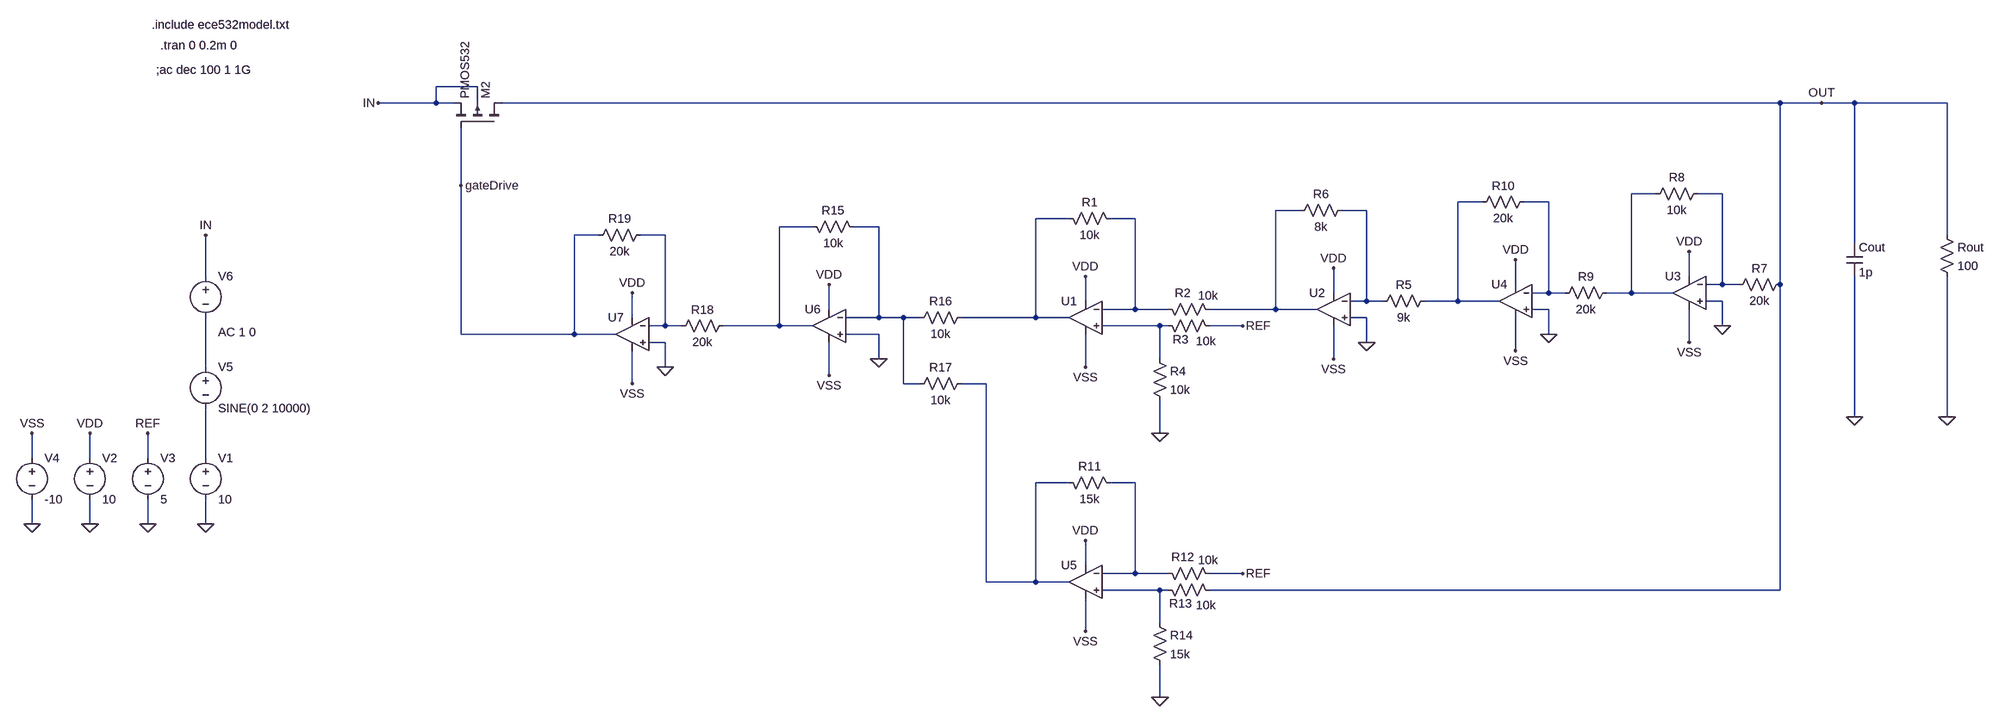
[diagram p0: schematic LDO_v2_compensated_feedback.asc]
LDO_v2_compensated_feedback.asc, the LTspice schematic file:
Version 4
SHEET 1 3668 1268
WIRE -272 64 -352 64
WIRE -352 96 -352 64
WIRE -352 96 -656 96
WIRE -320 96 -352 96
WIRE -272 96 -272 64
WIRE 2368 96 -224 96
WIRE 2448 96 2368 96
WIRE 2512 96 2448 96
WIRE 2704 96 2512 96
WIRE -304 256 -304 144
WIRE 2128 272 2080 272
WIRE 2256 272 2208 272
WIRE 1792 288 1744 288
WIRE 1920 288 1872 288
WIRE 1440 304 1392 304
WIRE 1568 304 1520 304
WIRE 992 320 928 320
WIRE 1120 320 1072 320
WIRE 496 336 432 336
WIRE 624 336 576 336
WIRE 48 352 0 352
WIRE 176 352 128 352
WIRE 2704 352 2704 96
WIRE 2512 368 2512 96
WIRE -1088 432 -1088 352
WIRE 2192 432 2192 384
WIRE 1856 448 1856 400
WIRE 2256 448 2256 272
WIRE 2256 448 2224 448
WIRE 2288 448 2256 448
WIRE 2368 448 2368 96
WIRE 1504 464 1504 416
WIRE 1920 464 1920 288
WIRE 1920 464 1888 464
WIRE 1952 464 1920 464
WIRE 2080 464 2080 272
WIRE 2080 464 2032 464
WIRE 2160 464 2080 464
WIRE 1024 480 1024 432
WIRE 1568 480 1568 304
WIRE 1568 480 1536 480
WIRE 1600 480 1568 480
WIRE 1744 480 1744 288
WIRE 1744 480 1680 480
WIRE 1824 480 1744 480
WIRE 2256 480 2224 480
WIRE 528 496 528 448
WIRE 1120 496 1120 320
WIRE 1120 496 1056 496
WIRE 1184 496 1120 496
WIRE 1392 496 1392 304
WIRE 1392 496 1264 496
WIRE 1472 496 1392 496
WIRE 1920 496 1888 496
WIRE 112 512 112 464
WIRE 624 512 624 336
WIRE 624 512 560 512
WIRE 672 512 624 512
WIRE 704 512 672 512
WIRE 928 512 928 320
WIRE 928 512 784 512
WIRE 992 512 928 512
WIRE 1568 512 1536 512
WIRE 176 528 176 352
WIRE 176 528 144 528
WIRE 208 528 176 528
WIRE 432 528 432 336
WIRE 432 528 288 528
WIRE 496 528 432 528
WIRE 1168 528 1056 528
WIRE 1184 528 1168 528
WIRE 1328 528 1264 528
WIRE 2256 528 2256 480
WIRE -304 544 -304 256
WIRE 0 544 0 352
WIRE 0 544 -304 544
WIRE 80 544 0 544
WIRE 624 544 560 544
WIRE 1920 544 1920 496
WIRE 176 560 144 560
WIRE 1568 560 1568 512
WIRE 2192 560 2192 496
WIRE 1856 576 1856 512
WIRE 624 592 624 544
WIRE 1168 592 1168 528
WIRE 1504 592 1504 528
WIRE -1088 608 -1088 512
WIRE 176 608 176 560
WIRE 1024 608 1024 544
WIRE 528 624 528 560
WIRE 112 640 112 576
WIRE 672 640 672 512
WIRE 704 640 672 640
WIRE 832 640 784 640
WIRE 2512 704 2512 432
WIRE 2704 704 2704 432
WIRE 1168 736 1168 672
WIRE -1424 784 -1424 736
WIRE -1312 784 -1312 736
WIRE -1200 784 -1200 736
WIRE -1088 784 -1088 688
WIRE 992 832 928 832
WIRE 1120 832 1072 832
WIRE -1424 912 -1424 864
WIRE -1312 912 -1312 864
WIRE -1200 912 -1200 864
WIRE -1088 912 -1088 864
WIRE 1024 992 1024 944
WIRE 1120 1008 1120 832
WIRE 1120 1008 1056 1008
WIRE 1184 1008 1120 1008
WIRE 1328 1008 1264 1008
WIRE 832 1024 832 640
WIRE 928 1024 928 832
WIRE 928 1024 832 1024
WIRE 992 1024 928 1024
WIRE 1168 1040 1056 1040
WIRE 1184 1040 1168 1040
WIRE 2368 1040 2368 448
WIRE 2368 1040 1264 1040
WIRE 1168 1104 1168 1040
WIRE 1024 1120 1024 1056
WIRE 1168 1248 1168 1184
FLAG 2512 704 0
FLAG -1312 912 0
FLAG -1312 736 VDD
FLAG 2704 704 0
FLAG -304 256 gateDrive
FLAG -1200 912 0
FLAG 1168 736 0
FLAG 1024 432 VDD
FLAG 1024 608 VSS
FLAG 1504 416 VDD
FLAG 1504 592 VSS
FLAG 1568 560 0
FLAG 1328 528 REF
FLAG 2192 384 VDD
FLAG 2192 560 VSS
FLAG 2256 528 0
FLAG 1856 400 VDD
FLAG 1856 576 VSS
FLAG 1920 544 0
FLAG 2448 96 OUT
FLAG -1200 736 REF
FLAG -1424 912 0
FLAG -1424 736 VSS
FLAG -1088 912 0
FLAG -656 96 IN
FLAG -1088 352 IN
FLAG 1168 1248 0
FLAG 1024 944 VDD
FLAG 1024 1120 VSS
FLAG 528 448 VDD
FLAG 528 624 VSS
FLAG 624 592 0
FLAG 112 464 VDD
FLAG 112 640 VSS
FLAG 176 608 0
FLAG 1328 1008 REF
SYMBOL cap 2496 368 R0
SYMATTR InstName Cout
SYMATTR Value 1p
SYMBOL voltage -1312 768 R0
WINDOW 123 0 0 Left 2
WINDOW 39 0 0 Left 2
SYMATTR InstName V2
SYMATTR Value 10
SYMBOL res 2688 336 R0
SYMATTR InstName Rout
SYMATTR Value 100
SYMBOL voltage -1200 768 R0
WINDOW 123 0 0 Left 2
WINDOW 39 0 0 Left 2
SYMATTR InstName V3
SYMATTR Value 5
SYMBOL res 976 304 M90
WINDOW 0 0 56 VBottom 2
WINDOW 3 32 56 VTop 2
SYMATTR InstName R1
SYMATTR Value 10k
SYMBOL res 1168 480 M90
WINDOW 0 0 44 VBottom 2
WINDOW 3 -26 93 VTop 2
SYMATTR InstName R2
SYMATTR Value 10k
SYMBOL res 1168 512 M90
WINDOW 0 58 40 VBottom 2
WINDOW 3 30 89 VTop 2
SYMATTR InstName R3
SYMATTR Value 10k
SYMBOL res 1152 576 R0
SYMATTR InstName R4
SYMATTR Value 10k
SYMBOL Opamps\\UniversalOpamp2 1024 512 M0
SYMATTR InstName U1
SYMBOL Opamps\\UniversalOpamp2 1504 496 M0
SYMATTR InstName U2
SYMBOL res 1584 496 R270
WINDOW 0 32 56 VTop 2
WINDOW 3 0 56 VBottom 2
SYMATTR InstName R5
SYMATTR Value 9k
SYMBOL res 1424 320 R270
WINDOW 0 32 56 VTop 2
WINDOW 3 0 56 VBottom 2
SYMATTR InstName R6
SYMATTR Value 8k
SYMBOL Opamps\\UniversalOpamp2 2192 464 M0
SYMATTR InstName U3
SYMBOL res 2272 464 R270
WINDOW 0 32 56 VTop 2
WINDOW 3 0 56 VBottom 2
SYMATTR InstName R7
SYMATTR Value 20k
SYMBOL res 2112 288 R270
WINDOW 0 32 56 VTop 2
WINDOW 3 0 56 VBottom 2
SYMATTR InstName R8
SYMATTR Value 10k
SYMBOL Opamps\\UniversalOpamp2 1856 480 M0
SYMATTR InstName U4
SYMBOL res 1936 480 R270
WINDOW 0 32 56 VTop 2
WINDOW 3 0 56 VBottom 2
SYMATTR InstName R9
SYMATTR Value 20k
SYMBOL res 1776 304 R270
WINDOW 0 32 56 VTop 2
WINDOW 3 0 56 VBottom 2
SYMATTR InstName R10
SYMATTR Value 20k
SYMBOL voltage -1424 768 R0
WINDOW 123 0 0 Left 2
WINDOW 39 0 0 Left 2
SYMATTR InstName V4
SYMATTR Value -10
SYMBOL pmos4 -224 144 M270
SYMATTR InstName M2
SYMATTR Value PMOS532
SYMATTR Value2 l=1u w=1000u m=1
SYMBOL voltage -1088 768 R0
WINDOW 123 0 0 Left 2
WINDOW 39 0 0 Left 2
SYMATTR InstName V1
SYMATTR Value 10
SYMBOL voltage -1088 592 R0
WINDOW 123 0 0 Left 2
WINDOW 39 0 0 Left 2
SYMATTR InstName V5
SYMATTR Value SINE(0 2 10000)
SYMBOL voltage -1088 416 R0
WINDOW 123 24 124 Left 2
WINDOW 39 0 0 Left 2
SYMATTR Value2 AC 1 0
SYMATTR InstName V6
SYMATTR Value ""
SYMBOL res 976 816 M90
WINDOW 0 0 56 VBottom 2
WINDOW 3 32 56 VTop 2
SYMATTR InstName R11
SYMATTR Value 15k
SYMBOL res 1168 992 M90
WINDOW 0 0 44 VBottom 2
WINDOW 3 -26 93 VTop 2
SYMATTR InstName R12
SYMATTR Value 10k
SYMBOL res 1168 1024 M90
WINDOW 0 58 40 VBottom 2
WINDOW 3 30 89 VTop 2
SYMATTR InstName R13
SYMATTR Value 10k
SYMBOL res 1152 1088 R0
SYMATTR InstName R14
SYMATTR Value 15k
SYMBOL Opamps\\UniversalOpamp2 1024 1024 M0
SYMATTR InstName U5
SYMBOL res 480 320 M90
WINDOW 0 0 56 VBottom 2
WINDOW 3 32 56 VTop 2
SYMATTR InstName R15
SYMATTR Value 10k
SYMBOL Opamps\\UniversalOpamp2 528 528 M0
SYMATTR InstName U6
SYMBOL res 688 528 R270
WINDOW 0 32 56 VTop 2
WINDOW 3 0 56 VBottom 2
SYMATTR InstName R16
SYMATTR Value 10k
SYMBOL res 688 656 R270
WINDOW 0 32 56 VTop 2
WINDOW 3 0 56 VBottom 2
SYMATTR InstName R17
SYMATTR Value 10k
SYMBOL Opamps\\UniversalOpamp2 112 544 M0
SYMATTR InstName U7
SYMBOL res 192 544 R270
WINDOW 0 32 56 VTop 2
WINDOW 3 0 56 VBottom 2
SYMATTR InstName R18
SYMATTR Value 20k
SYMBOL res 32 368 R270
WINDOW 0 32 56 VTop 2
WINDOW 3 0 56 VBottom 2
SYMATTR InstName R19
SYMATTR Value 20k
TEXT -1192 -56 Left 2 !.include ece532model.txt
TEXT -1176 -16 Left 2 !.tran 0 0.2m 0
TEXT -1184 32 Left 2 !;ac dec 100 1 1G

The netlist it stands for:
* LDO_v2_compensated_feedback.asc
Cout OUT 0 1p
V2 VDD 0 10
Rout OUT 0 100
V3 REF 0 5
R1 N007 N008 10k
R2 N008 N005 10k
R3 N012 REF 10k
R4 N012 0 10k
XU1 N012 N008 VDD VSS N007 level.2 Avol=1Meg GBW=10Meg Slew=10Meg ilimit=25m rail=0 Vos=0 phimargin=45 en=0 enk=0 in=0 ink=0 Rin=500Meg  ; pins IN+ IN- V+ V- OUT
XU2 0 N006 VDD VSS N005 level.2 Avol=1Meg GBW=10Meg Slew=10Meg ilimit=25m rail=0 Vos=0 phimargin=45 en=0 enk=0 in=0 ink=0 Rin=500Meg  ; pins IN+ IN- V+ V- OUT
R5 N006 N003 9k
R6 N005 N006 8k
XU3 0 N002 VDD VSS N001 level.2 Avol=1Meg GBW=10Meg Slew=10Meg ilimit=25m rail=0 Vos=0 phimargin=45 en=0 enk=0 in=0 ink=0 Rin=500Meg  ; pins IN+ IN- V+ V- OUT
R7 N002 OUT 20k
R8 N001 N002 10k
XU4 0 N004 VDD VSS N003 level.2 Avol=1Meg GBW=10Meg Slew=10Meg ilimit=25m rail=0 Vos=0 phimargin=45 en=0 enk=0 in=0 ink=0 Rin=500Meg  ; pins IN+ IN- V+ V- OUT
R9 N004 N001 20k
R10 N003 N004 20k
V4 VSS 0 -10
M2 OUT gateDrive IN IN PMOS532 l=1u w=1000u m=1
V1 N015 0 10
V5 N013 N015 SINE(0 2 10000)
V6 IN N013 AC 1 0
R11 N014 N016 15k
R12 N016 REF 10k
R13 N017 OUT 10k
R14 N017 0 15k
XU5 N017 N016 VDD VSS N014 level.2 Avol=1Meg GBW=10Meg Slew=10Meg ilimit=25m rail=0 Vos=0 phimargin=45 en=0 enk=0 in=0 ink=0 Rin=500Meg  ; pins IN+ IN- V+ V- OUT
R15 N009 N010 10k
XU6 0 N010 VDD VSS N009 level.2 Avol=1Meg GBW=10Meg Slew=10Meg ilimit=25m rail=0 Vos=0 phimargin=45 en=0 enk=0 in=0 ink=0 Rin=500Meg  ; pins IN+ IN- V+ V- OUT
R16 N010 N007 10k
R17 N010 N014 10k
XU7 0 N011 VDD VSS gateDrive level.2 Avol=1Meg GBW=10Meg Slew=10Meg ilimit=25m rail=0 Vos=0 phimargin=45 en=0 enk=0 in=0 ink=0 Rin=500Meg  ; pins IN+ IN- V+ V- OUT
R18 N011 N009 20k
R19 gateDrive N011 20k
.model NMOS NMOS
.model PMOS PMOS
.lib standard.mos
.include ece532model.txt
.tran 0 0.2m 0
;ac dec 100 1 1G
.lib UniversalOpamps2.sub
.backanno
.end